# EAGLE design mimic1568_DtoA (EAGLE 7.5.0)
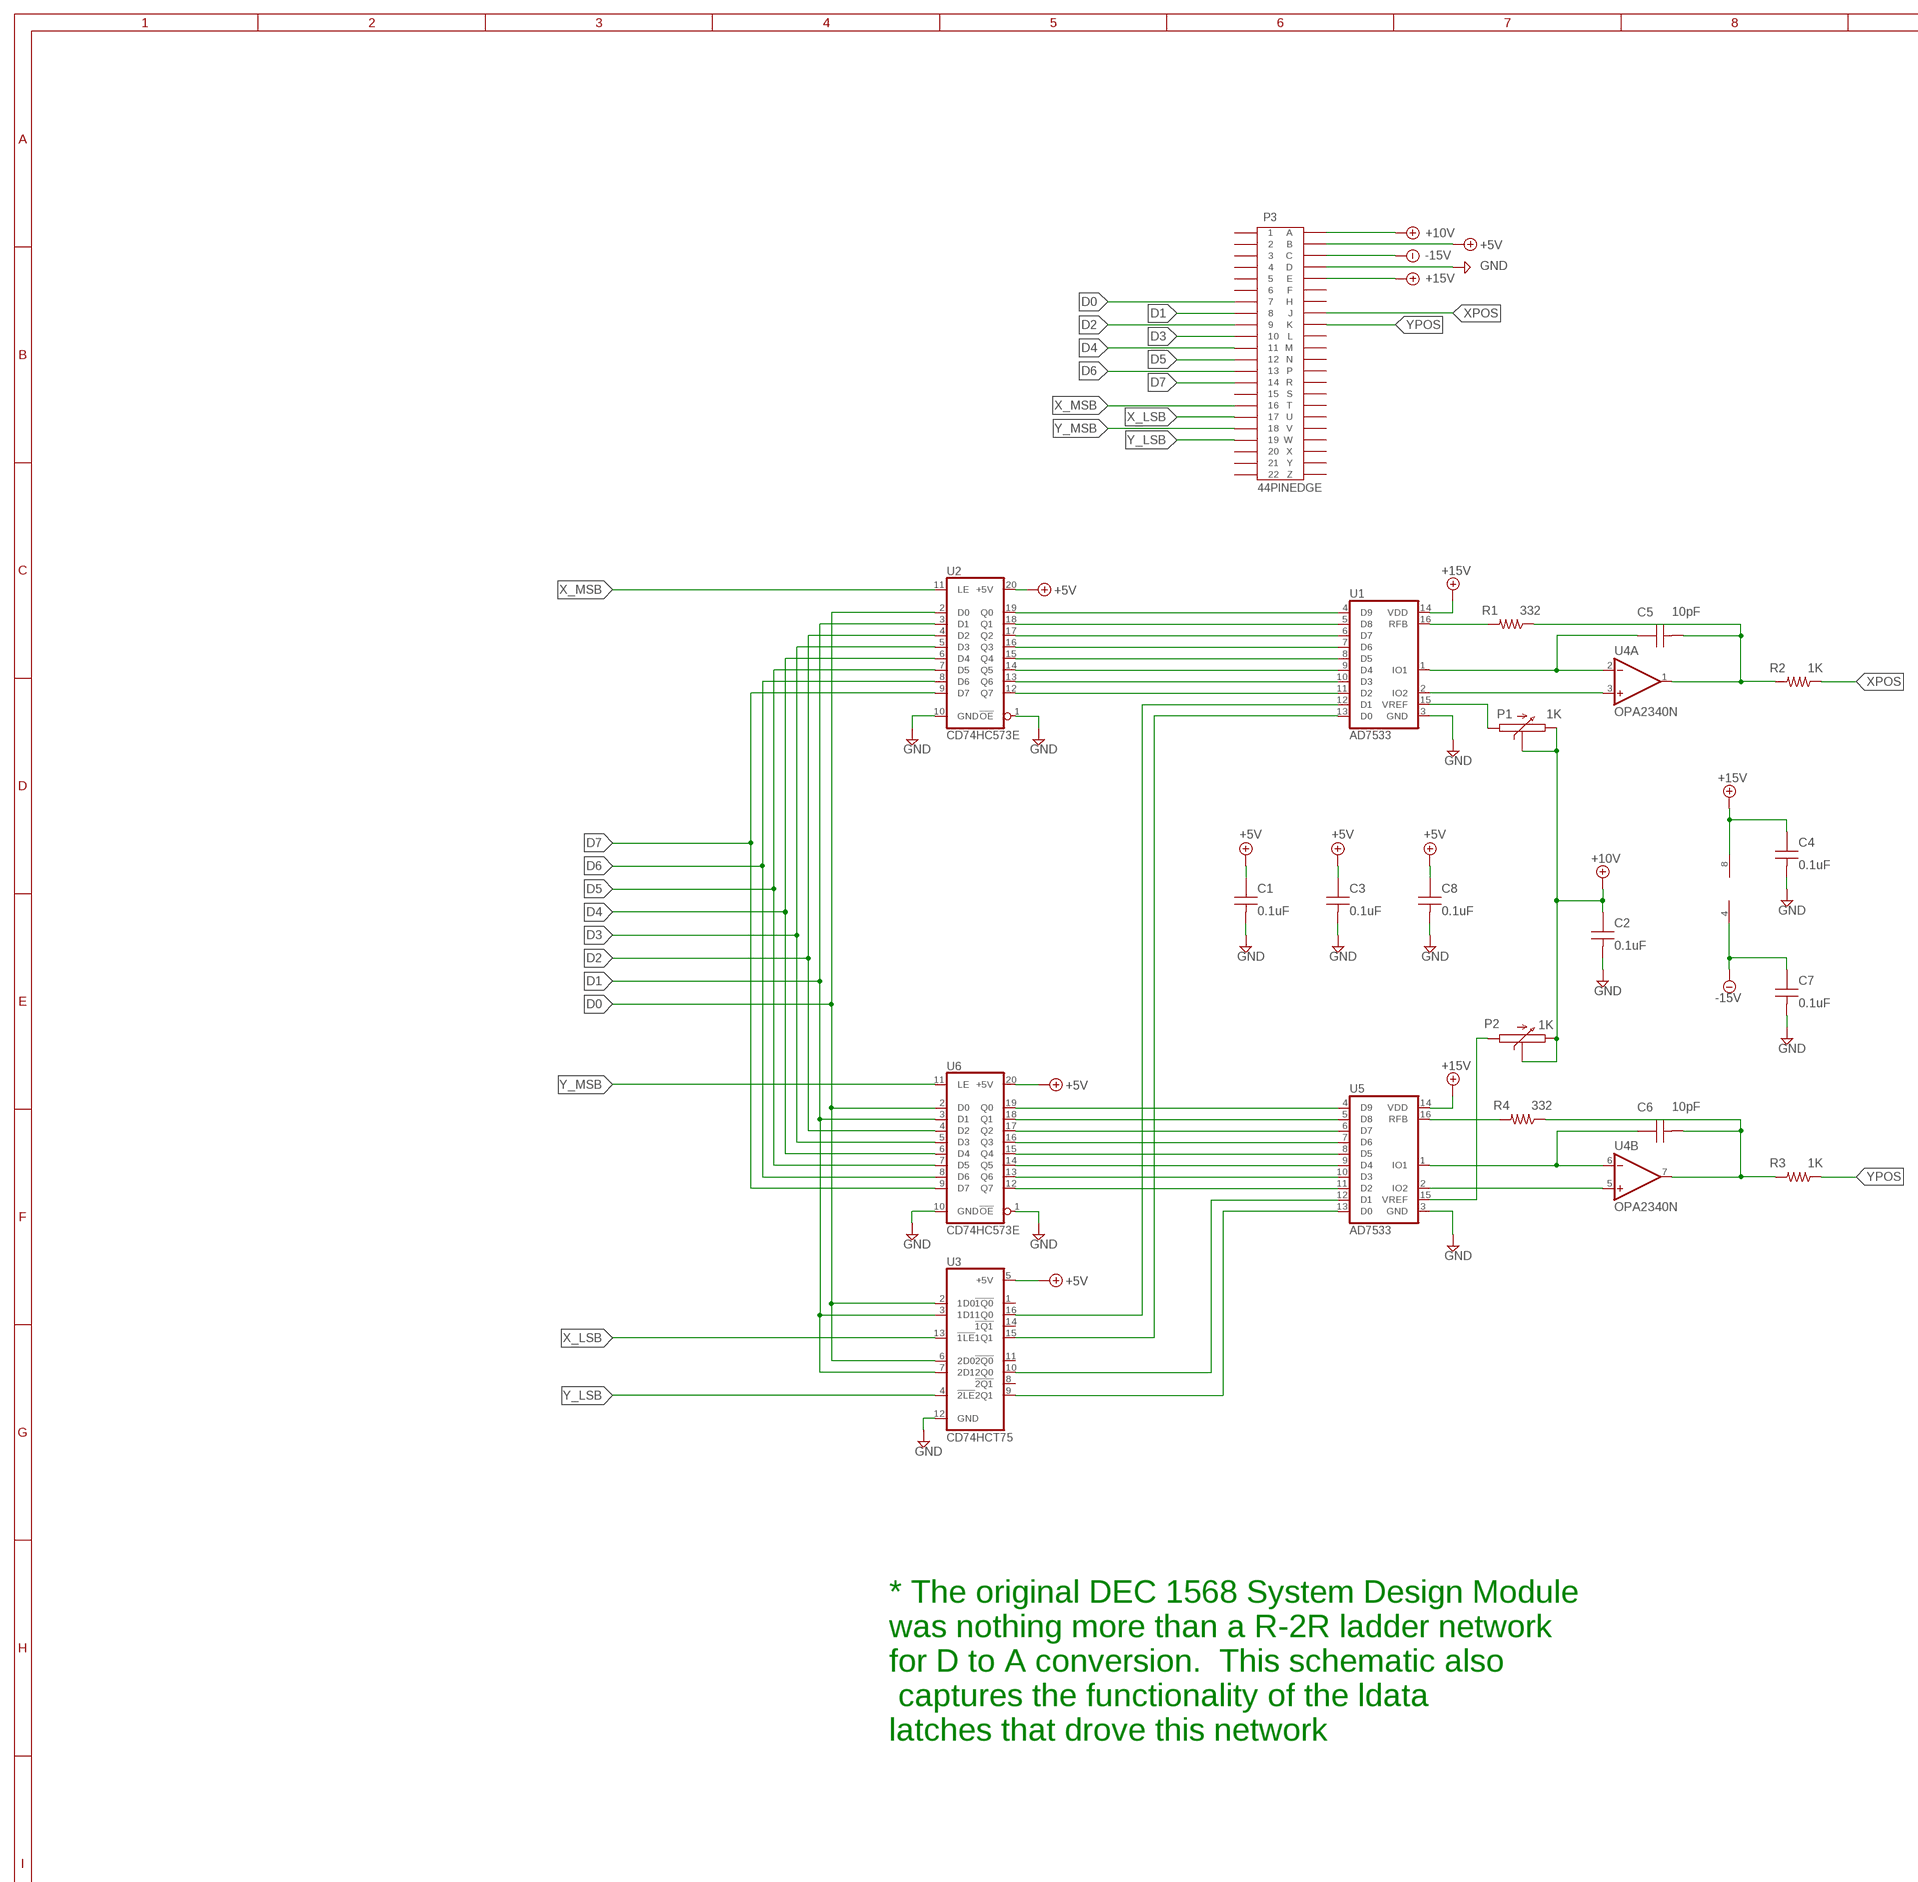
[diagram p0: schematic, sheet 1, part 1 of 2]
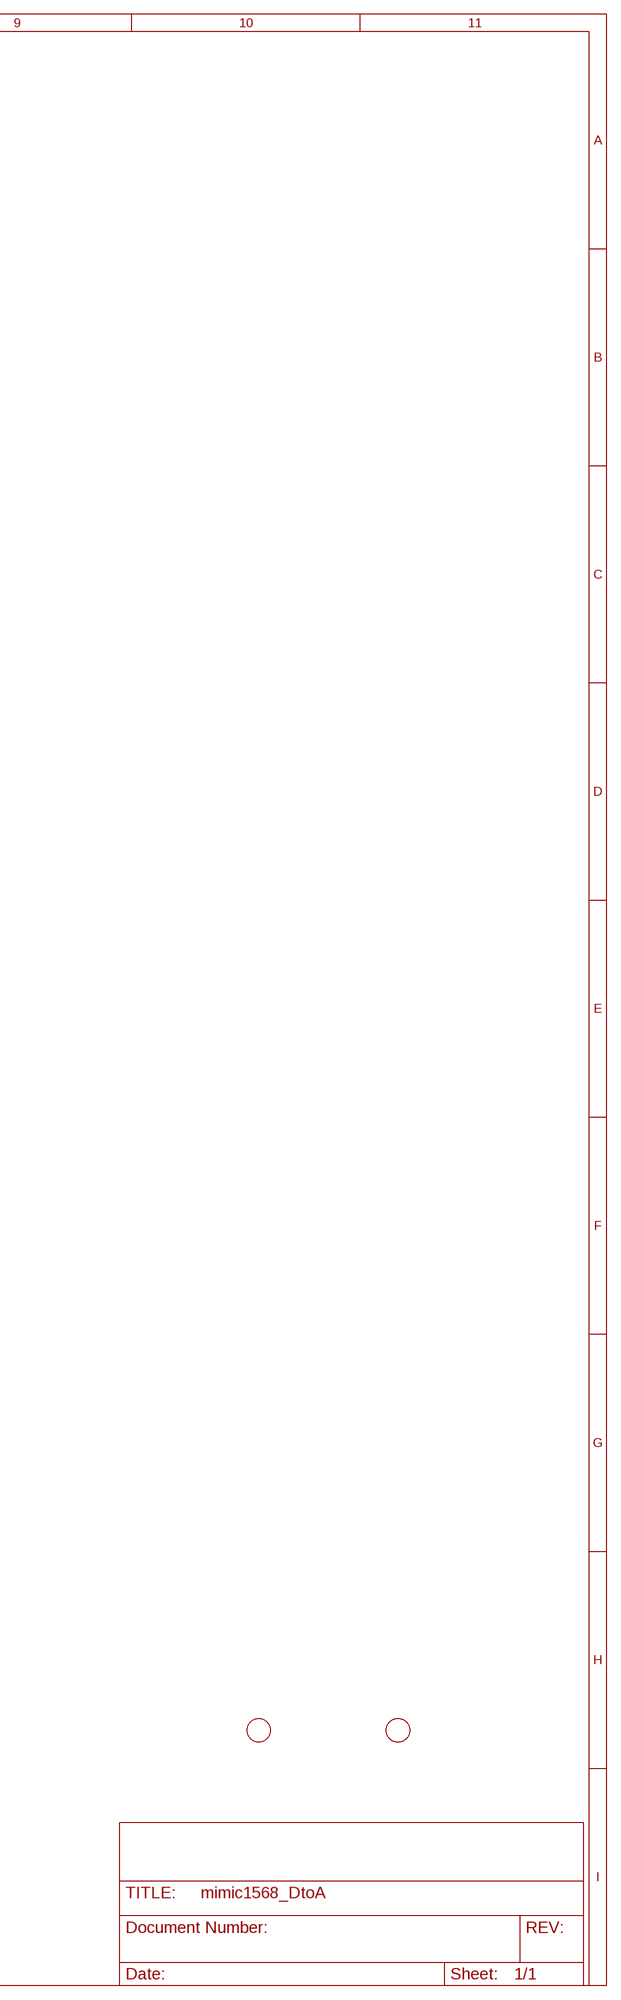
[diagram p1: schematic, sheet 1, part 2 of 2]

## Parts
C1  0.1uF  CAP0.1UF100V  [5MM_TH]
C2  0.1uF  CAP0.1UF100V  [5MM_TH]
C3  0.1uF  CAP0.1UF100V  [5MM_TH]
C4  0.1uF  CAP0.1UF100V  [5MM_TH]
C5  10pF  CAP0.1UF100V  [5MM_TH]
C6  10pF  CAP0.1UF100V  [5MM_TH]
C7  0.1uF  CAP0.1UF100V  [5MM_TH]
C8  0.1uF  CAP0.1UF100V  [5MM_TH]
P1  1K  POT-3006P  [3006P]
P2  1K  POT-3006P  [3006P]
P3  44PINEDGE  [44PINEDGE]
R1  332  R-1/4WATT  [0207/10]
R2  1K  R-1/4WATT  [0207/10]
R3  1K  R-1/4WATT  [0207/10]
R4  332  R-1/4WATT  [0207/10]
U1  AD7533  [DIP-16]
U2  CD74HC573E  [DIP-20]
U3  CD74HCT75  [DIP-16]
U4  OPA2340N  [DIP-08]
U5  AD7533  [DIP-16]
U6  CD74HC573E  [DIP-20]
U$1  FIDUCIAL  [FIDUCIAL_1MM]
U$2  FIDUCIAL  [FIDUCIAL_1MM]

## Nets
+5V: C1.1 C3.1 C8.1 P3.B U2.20(+5V) U3.5(+5V) U6.20(+5V)
+10V: C2.1 P1.2 P1.3 P2.2 P2.3 P3.A
+15V: C4.1 P3.E U1.14(VDD) U4.8(P:V+) U5.14(VDD)
-15V: C7.1 P3.C U4.4(P:V-)
D0: P3.7 U2.2(D0) U3.2(1D0) U3.6(2D0) U6.2(D0)
D1: P3.8 U2.3(D1) U3.3(1D1) U3.7(2D1) U6.3(D1)
D2: P3.9 U2.4(D2) U6.4(D2)
D3: P3.10 U2.5(D3) U6.5(D3)
D4: P3.11 U2.6(D4) U6.6(D4)
D5: P3.12 U2.7(D5) U6.7(D5)
D6: P3.13 U2.8(D6) U6.8(D6)
D7: P3.14 U2.9(D7) U6.9(D7)
GND: C1.2 C2.2 C3.2 C4.2 C7.2 C8.2 P3.D U1.3(GND) U2.1(!OE) U2.10(GND) U3.12(GND) U5.3(GND) U6.1(!OE) U6.10(GND)
N$1: U3.9(2Q1) U5.13(D0)
N$2: R4.2 U5.16(RFB)
N$3: U1.12(D1) U3.16(1Q0)
N$4: U1.13(D0) U3.15(1Q1)
N$5: C5.1 U1.1(IO1) U4.2(A:-IN)
N$6: U1.2(IO2) U4.3(A:+IN)
N$7: U5.4(D9) U6.19(Q0)
N$8: U5.5(D8) U6.18(Q1)
N$9: U5.6(D7) U6.17(Q2)
N$10: U5.7(D6) U6.16(Q3)
N$11: U5.8(D5) U6.15(Q4)
N$12: U5.9(D4) U6.14(Q5)
N$13: U5.10(D3) U6.13(Q6)
N$14: U5.11(D2) U6.12(Q7)
N$23: C5.2 R1.1 R2.2 U4.1(A:OUT)
N$24: P1.1 U1.15(VREF)
N$25: U1.4(D9) U2.19(Q0)
N$26: U1.5(D8) U2.18(Q1)
N$27: U1.6(D7) U2.17(Q2)
N$28: U1.7(D6) U2.16(Q3)
N$29: U1.8(D5) U2.15(Q4)
N$30: U1.9(D4) U2.14(Q5)
N$31: U1.10(D3) U2.13(Q6)
N$32: U1.11(D2) U2.12(Q7)
N$35: U3.10(2Q0) U5.12(D1)
N$38: R1.2 U1.16(RFB)
N$44: C6.2 R3.2 R4.1 U4.7(B:OUT)
N$45: C6.1 U4.6(B:-IN) U5.1(IO1)
N$46: U4.5(B:+IN) U5.2(IO2)
N$53: P2.1 U5.15(VREF)
X_LSB: P3.17 U3.13(!1LE)
X_MSB: P3.16 U2.11(LE)
XPOS: P3.J R2.1
Y_LSB: P3.19 U3.4(!2LE)
Y_MSB: P3.18 U6.11(LE)
YPOS: P3.K R3.1
Unconnected: P3.1 P3.2 P3.3 P3.4 P3.5 P3.6 P3.15 P3.20 P3.21 P3.22 P3.F P3.H P3.L P3.M P3.N P3.P P3.R P3.S P3.T P3.U P3.V P3.W P3.X P3.Y P3.Z U3.1(!1Q0) U3.8(!2Q1) U3.11(!2Q0) U3.14(!1Q1)

## Notes on the sheet
- * The original DEC 1568 System Design Module 
  was nothing more than a R-2R ladder network 
  for D to A conversion.  This schematic also
   captures the functionality of the ldata 
  latches that drove this network

## Library data of the parts
C1-C4 C7 C8 = keiths:CAP0.1UF100V: 0.1µF ±10% 100V Ceramic X8R TH; MPN: FA26X8R2A104KNU06
C5 C6 = keiths:CAP0.1UF100V: 0.1µF ±10% 100V Ceramic X8R TH; MPN: FA26X8R2A104KNU06; VALUE: 0.1uF
P1 P2 = keiths:POT-3006P: 3006 - Trimpot® Trimming Potentiometer. Clockwise turn moves wiper to pin 3
P3 = keiths:44PINEDGE: 44 PIN EDGE CONNECTOR FOR PCB
R1-R4 = keiths:R-1/4WATT: Quarter watt through hole resistor.
U1 U5 = keiths:AD7533: CMOS parallel input 10-Bit Multiplying DAC
U2 U6 = keiths:CD74HC573E: Octal Transparent D-Type Latches With 3-State Outputs
U3 = keiths:CD74HCT75: dual two bit transparant latch
U4 = keiths:OPA2340: SINGLE-SUPPLY, RAIL-TO-RAIL OP AMPS 5.5MHz
U$1 U$2 = adafruit:FIDUCIAL: For use by pick and place machines to calibrate the vision/machine, 1mm By microbuilder.eu

## Board
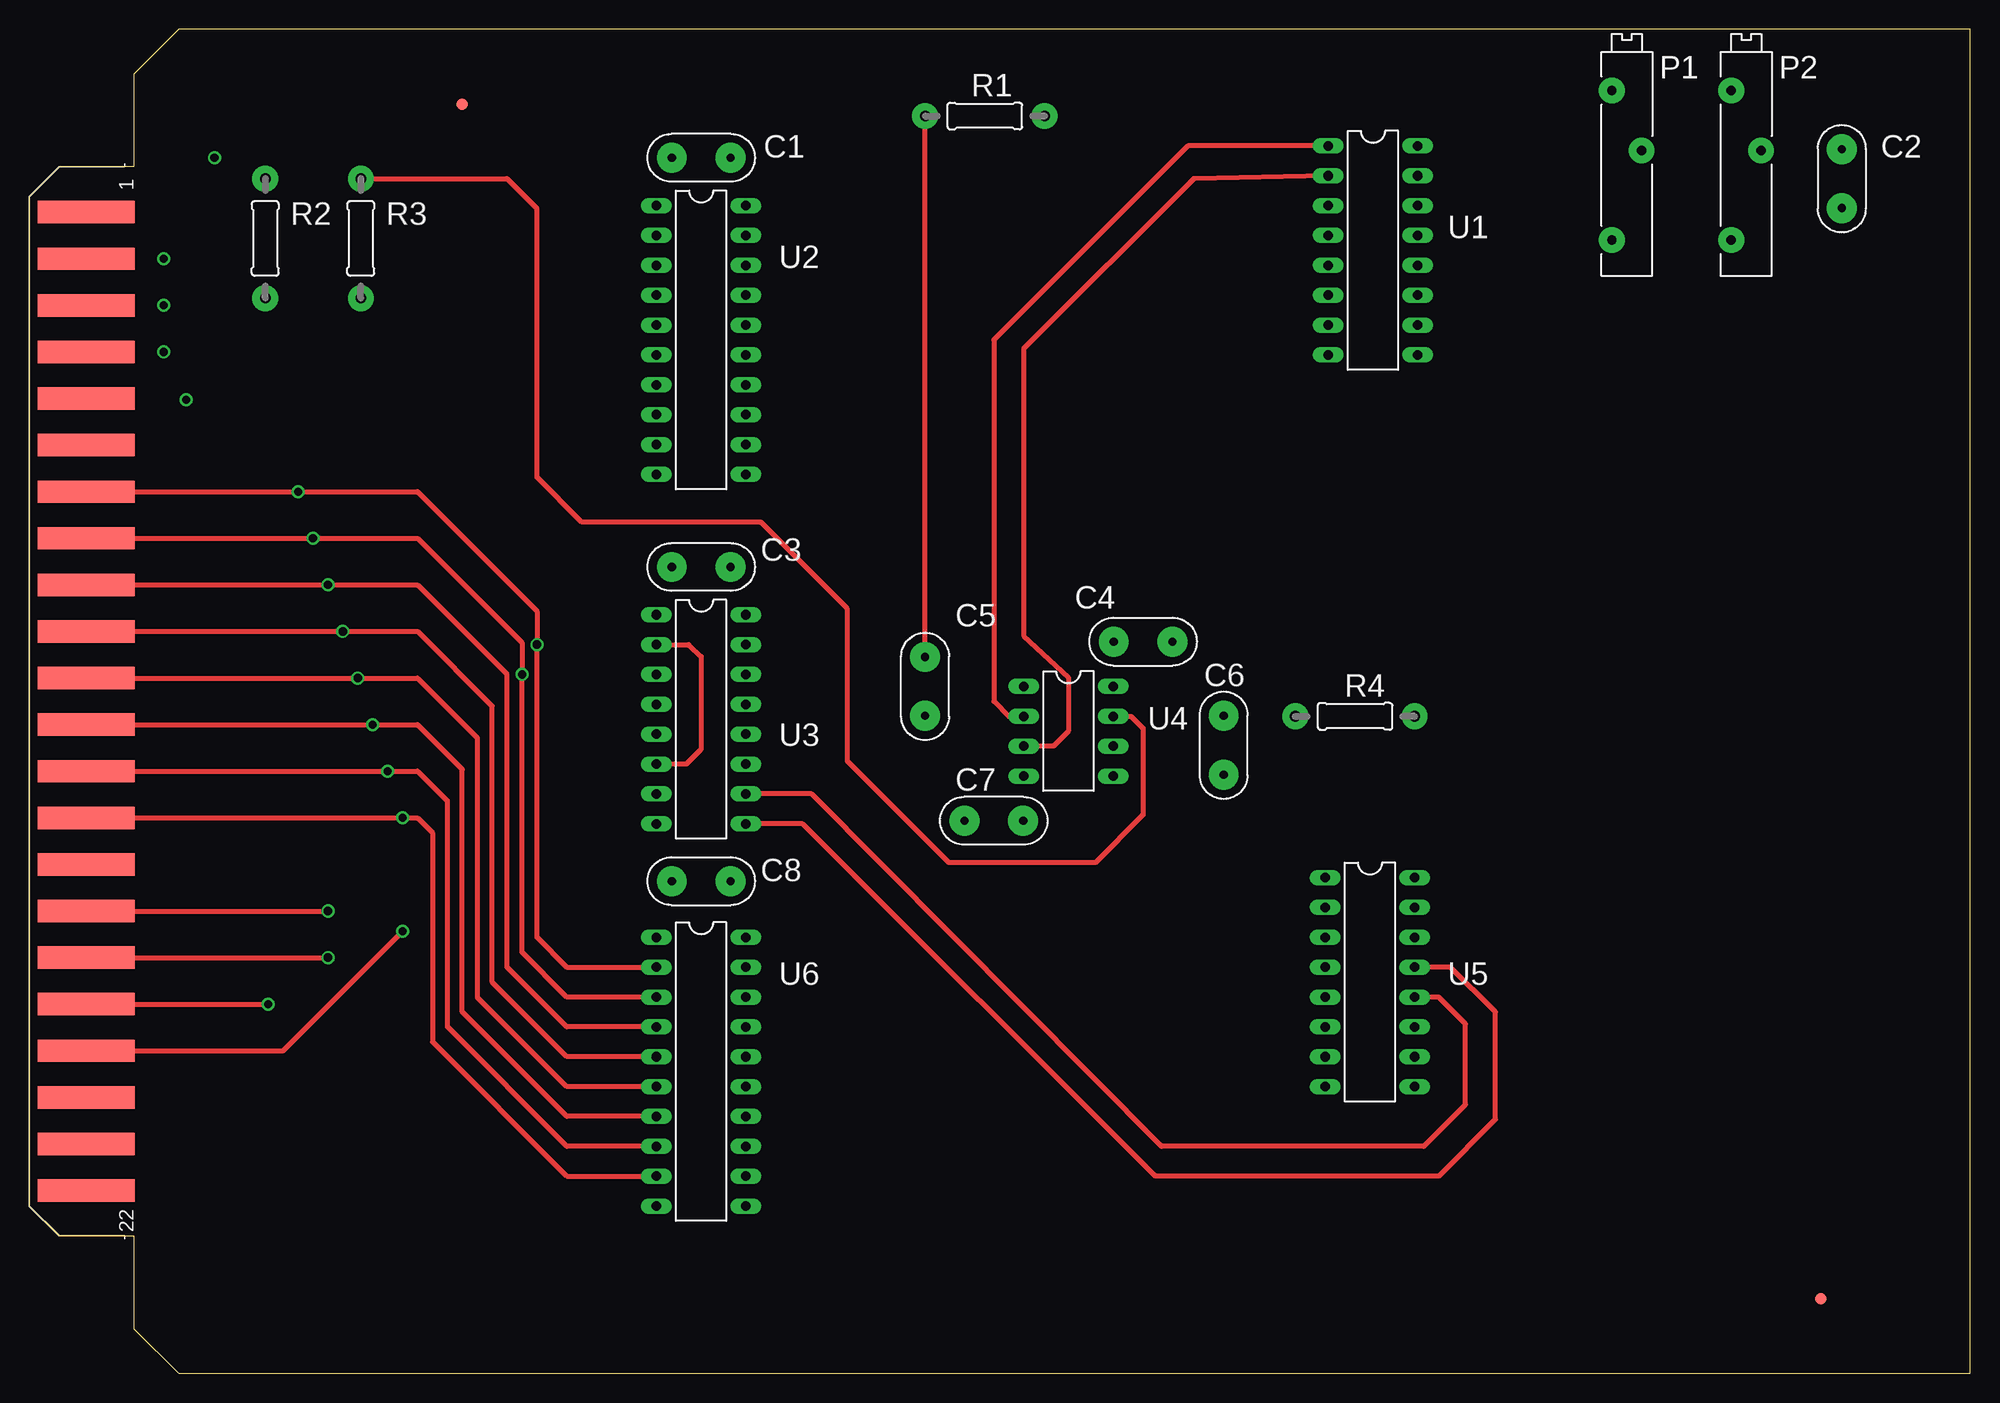
[diagram p2: board, top side]
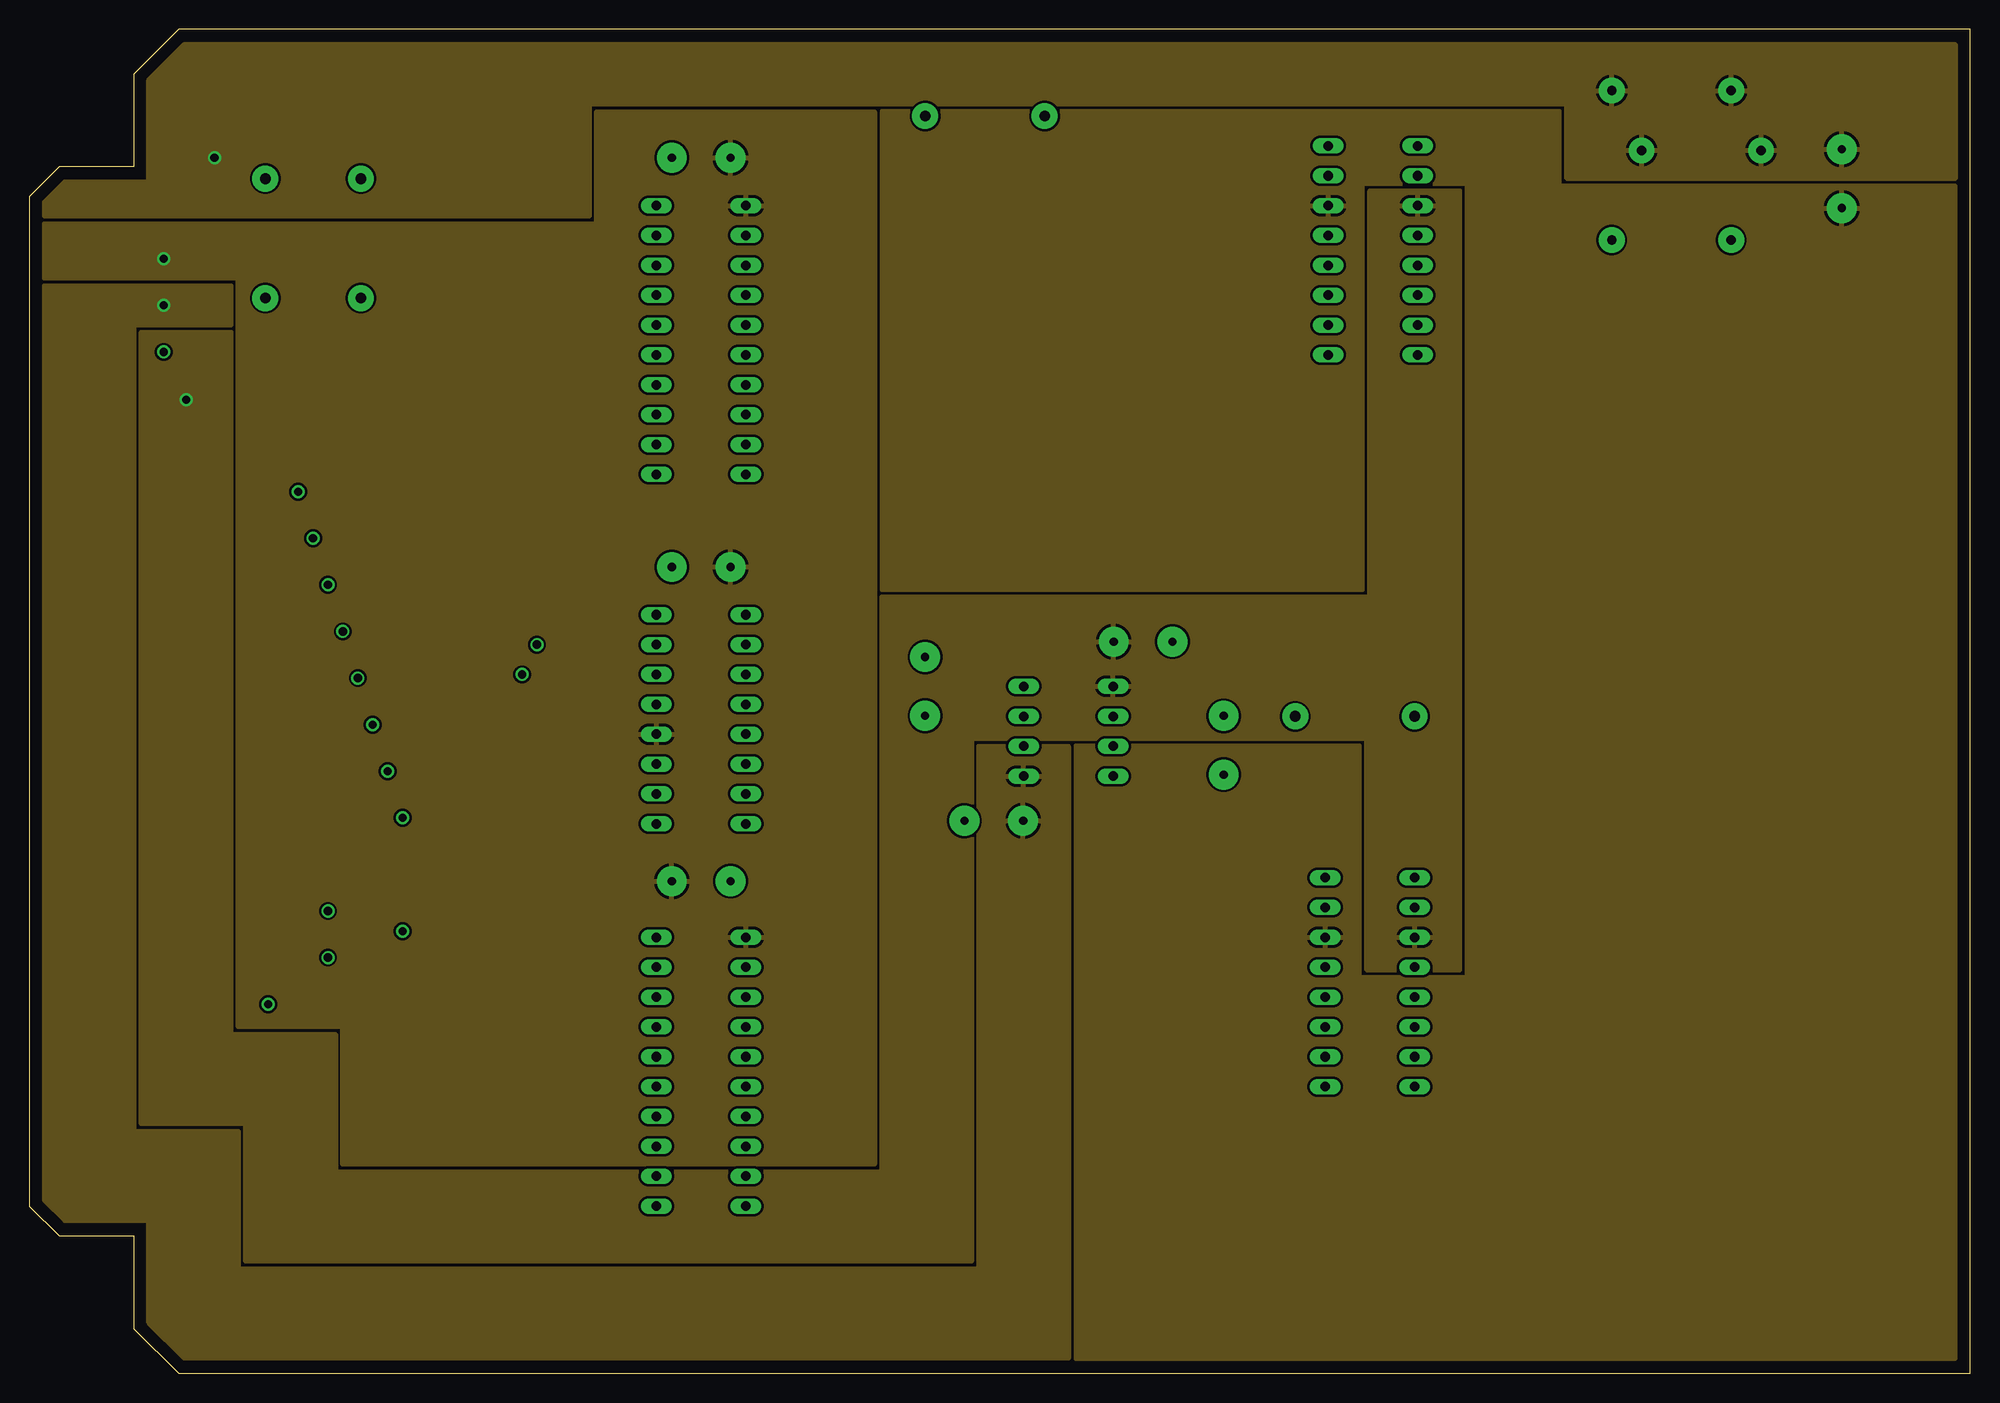
[diagram p3: board, inner layer VCC]
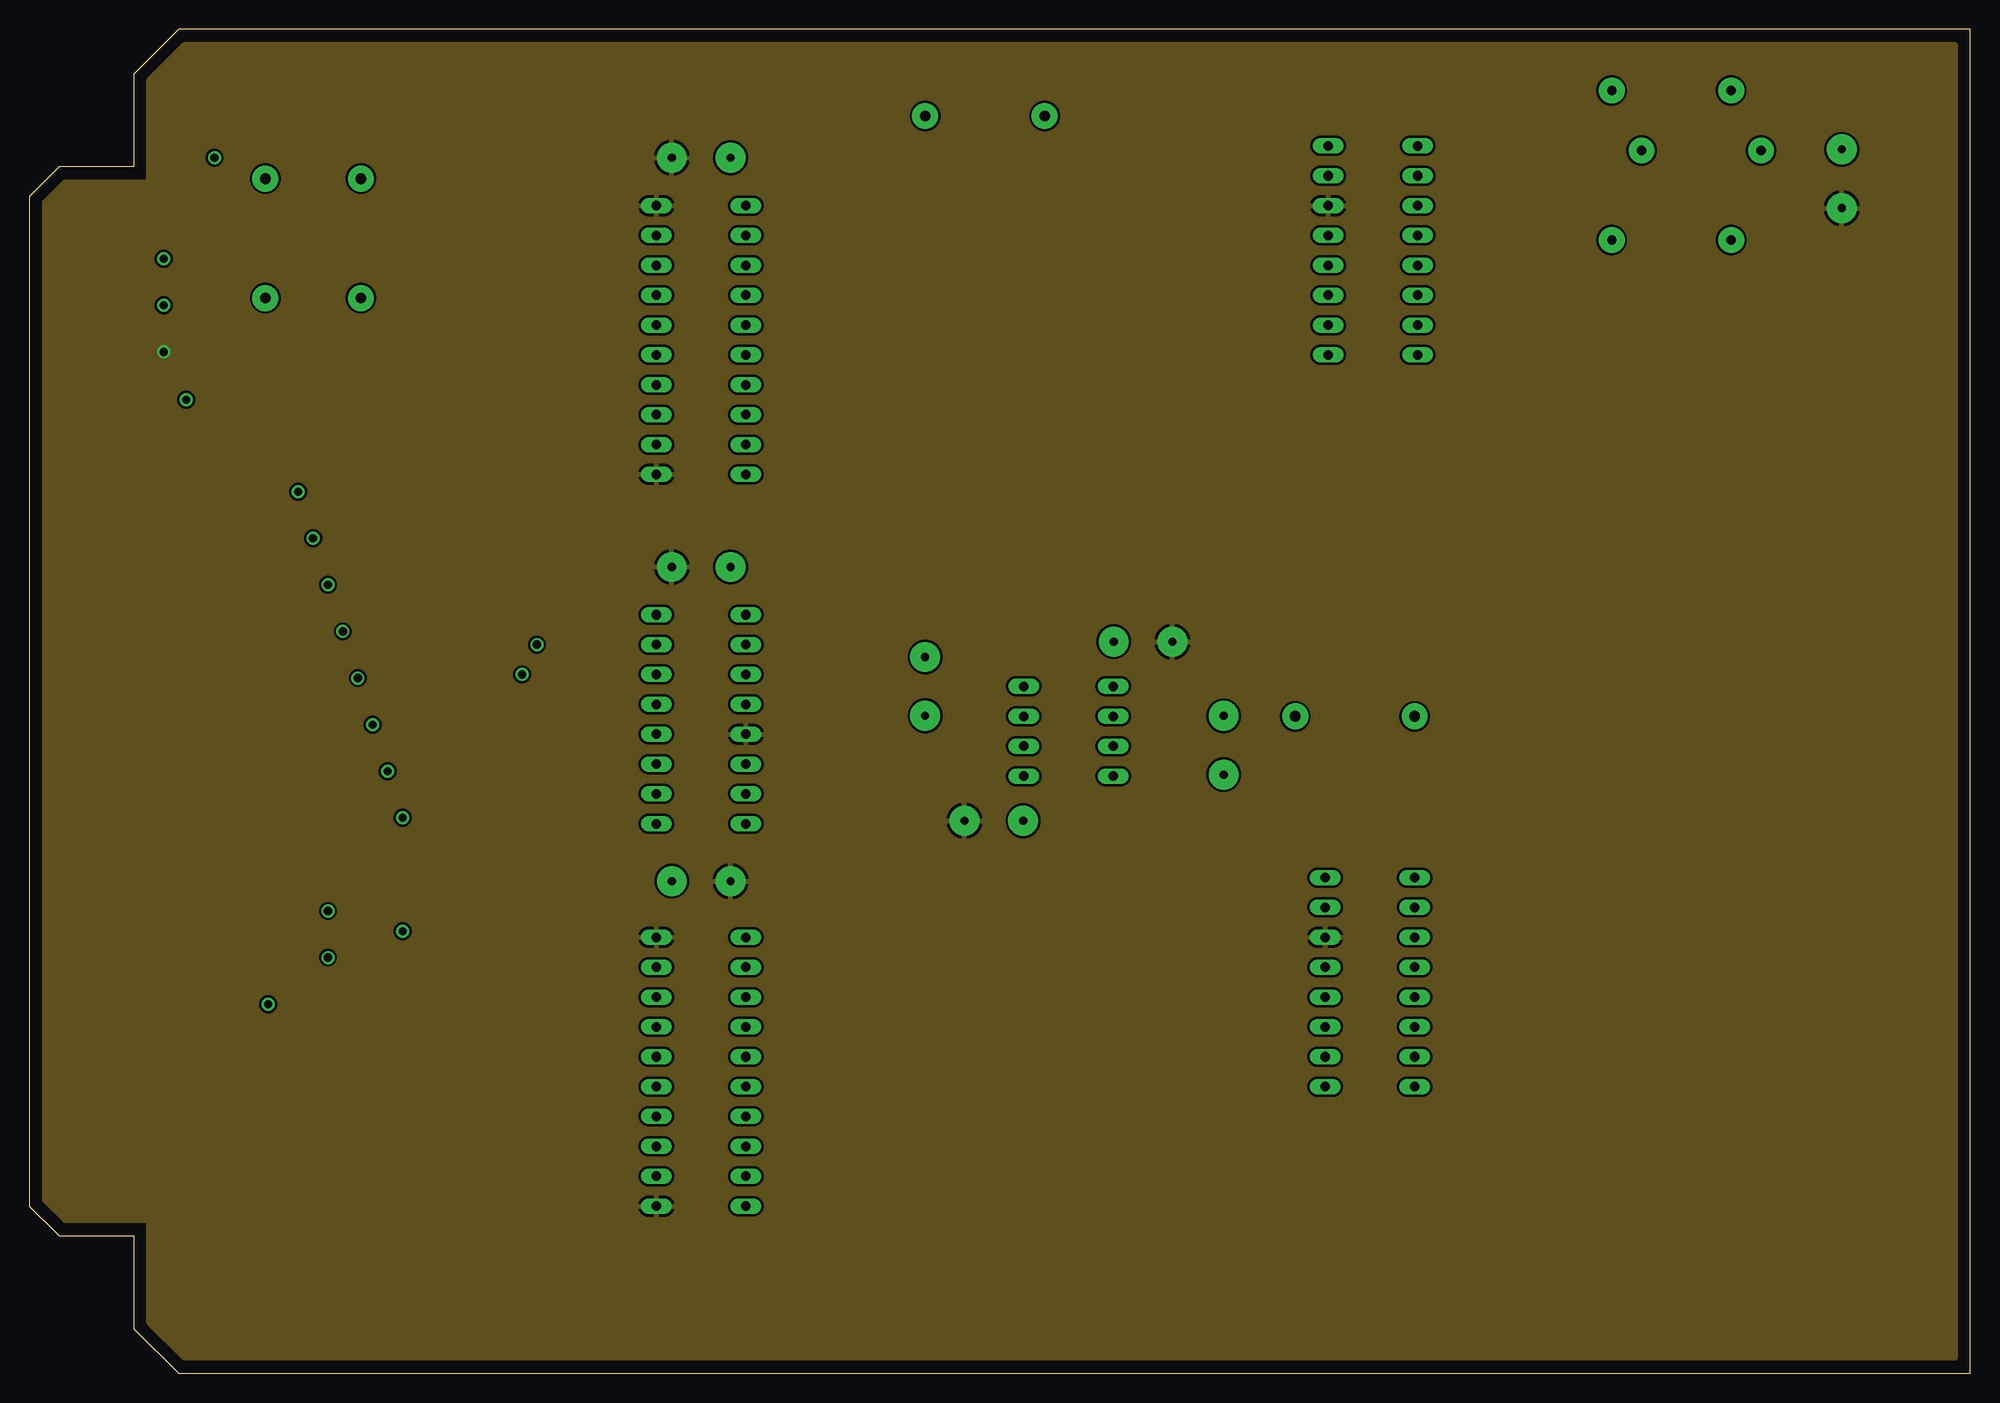
[diagram p4: board, inner layer GND]
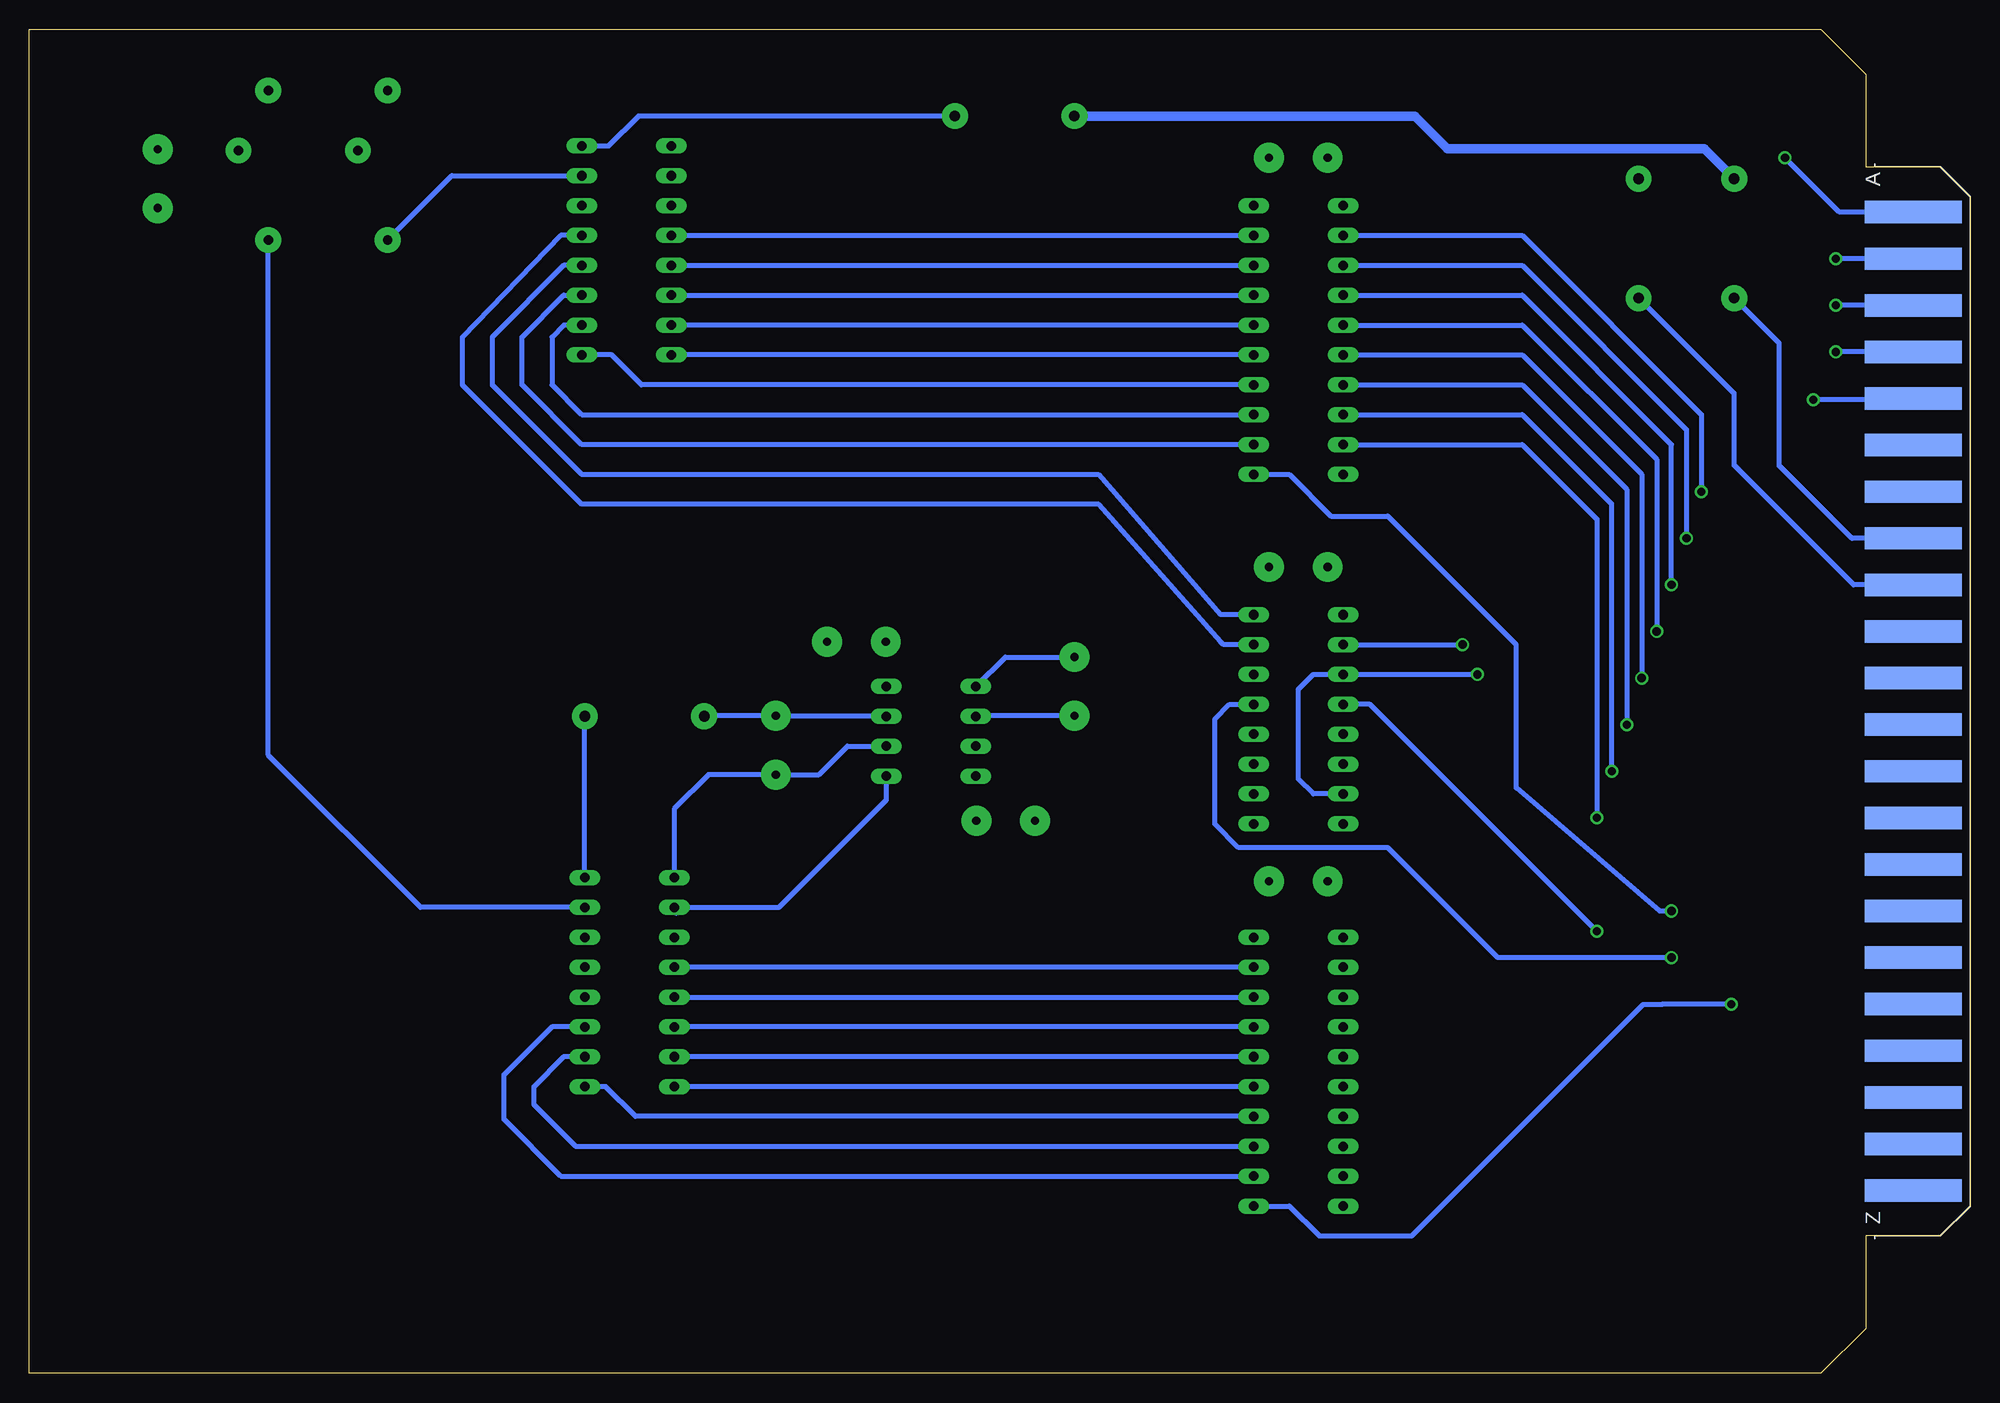
[diagram p5: board, bottom side, seen from below]

Size 165.1 x 114.3 mm. Coordinates in mm from the lower left corner, seen from the top.
Outline: 2.54,11.68 8.89,11.68 8.89,3.81 12.7,0 165.1,0 165.1,114.3 12.7,114.3 8.89,110.49 8.89,102.62 2.54,102.62 0,100.08 0,14.22 2.54,11.68
Copper layers (1+2*15+16): Top 0.035mm / dielectric 1.5mm / VCC 0.035mm / dielectric 0.15mm / GND 0.035mm / dielectric 0.2mm / Bottom 0.035mm
Design rules "default *": minimum track width 10mil, minimum drill 24mil, track to track 8mil, track to pad 8mil, pad to pad 8mil, via to via 8mil, smd to smd 8mil, copper to edge 40mil, drill to drill 8mil, minimum pad ring 10mil, minimum via ring 8mil, stop-mask expansion 4mil, vias tented up to drill 0mil, thermal gap 10mil

### Footprints (pad centres in the part's own frame; a part is rotated, then mirrored left to right if it is on the bottom)
5MM_TH = drill 0.7 pad 2.54: 1 -2.5,0; 2 2.5,0
3006P = drill 0.8 pad 2.184: 1 -6.477,1.27; 2 1.143,-1.27; 3 6.223,1.27
44PINEDGE = smd 1.905 x 8.255: 1 -41.605,4.826; 2 -37.643,4.826; 3 -33.68,4.826; 4 -29.718,4.826; 5 -25.756,4.826; 6 -21.793,4.826; 7 -17.831,4.826; 8 -13.868,4.826; 9 -9.906,4.826; 10 -5.944,4.826; 11 -1.981,4.826; 12 1.981,4.826; 13 5.944,4.826; 14 9.906,4.826; 15 13.868,4.826; 16 17.831,4.826; 17 21.793,4.826; 18 25.756,4.826; 19 29.718,4.826; 20 33.68,4.826; 21 37.643,4.826; 22 41.605,4.826 | smd 1.905 x 8.255 bottom: A -41.605,4.826; B -37.643,4.826; C -33.68,4.826; D -29.718,4.826; E -25.756,4.826; F -21.793,4.826; H -17.831,4.826; J -13.868,4.826; K -9.906,4.826; L -5.944,4.826; M -1.981,4.826; N 1.981,4.826; P 5.944,4.826; R 9.906,4.826; S 13.868,4.826; T 17.831,4.826; U 21.793,4.826; V 25.756,4.826; W 29.718,4.826; X 33.68,4.826; Y 37.643,4.826; Z 41.605,4.826
0207/10 = drill 0.9 pad 2.184: 1 -5.08,0; 2 5.08,0
DIP-16 = drill 0.813 long: 1 -8.89,-3.81; 2 -6.35,-3.81; 3 -3.81,-3.81; 4 -1.27,-3.81; 5 1.27,-3.81; 6 3.81,-3.81; 7 6.35,-3.81; 8 8.89,-3.81; 9 8.89,3.81; 10 6.35,3.81; 11 3.81,3.81; 12 1.27,3.81; 13 -1.27,3.81; 14 -3.81,3.81; 15 -6.35,3.81; 16 -8.89,3.81
DIP-20 = drill 0.813 long: 1 -11.43,-3.81; 2 -8.89,-3.81; 3 -6.35,-3.81; 4 -3.81,-3.81; 5 -1.27,-3.81; 6 1.27,-3.81; 7 3.81,-3.81; 8 6.35,-3.81; 9 8.89,-3.81; 10 11.43,-3.81; 11 11.43,3.81; 12 8.89,3.81; 13 6.35,3.81; 14 3.81,3.81; 15 1.27,3.81; 16 -1.27,3.81; 17 -3.81,3.81; 18 -6.35,3.81; 19 -8.89,3.81; 20 -11.43,3.81
DIP-08 = drill 0.813 long: 1 -3.81,-3.81; 2 -1.27,-3.81; 3 1.27,-3.81; 4 3.81,-3.81; 5 3.81,3.81; 6 1.27,3.81; 7 -1.27,3.81; 8 -3.81,3.81
FIDUCIAL_1MM = smd 1 x 1: 1 0,0

### Placement (x,y rotation side)
C1  57.15,103.38 180 top
C2  154.18,101.6 270 top
C3  57.15,68.58 180 top
C4  94.74,62.23 0 top
C5  76.2,58.42 90 top
C6  101.6,53.42 90 top
C7  82.04,46.99 180 top
C8  57.15,41.86 0 top
P1  135.89,102.87 90 top
P2  146.05,102.87 90 top
P3  0,57.15 270 top
R1  81.28,106.93 0 top
R2  20.07,96.52 90 top
R3  28.19,96.52 90 top
R4  112.78,55.88 0 top
U1  114.3,95.5 270 top
U2  57.15,87.88 270 top
U3  57.15,55.63 270 top
U4  88.39,54.61 270 top
U5  114.05,33.27 270 top
U6  57.15,25.65 270 top
U$1  36.83,107.95 0 top
U$2  152.4,6.35 0 top

### Tracks (layer width: path | path; a pad name or v marks a point on that pad's centre or on a via)
+5V  (via drill 0.7)
  Bottom 0.406: P3.B v11.43,94.79
  pour VCC: 48.26,107.31 71.88,107.31 71.88,17.78 26.67,17.78 26.67,29.46 17.78,29.46 17.78,93.12 1.27,93.12 1.27,97.79 48.26,97.79
+10V  (via drill 0.7)
  Bottom 0.406: P3.A 11.12,98.75 v15.75,103.38
  pour VCC: 47.62,98.42 1.27,98.42 1.27,99.57 3.05,101.35 10.16,101.35 10.16,109.98 13.21,113.03 163.83,113.03 163.83,101.6 130.81,101.6 130.81,107.95 47.62,107.95
+15V  (via drill 0.7)
  Bottom 0.406: P3.E 4.93,82.8 v13.34,82.8
  pour VCC: 9.53,88.54 17.14,88.54 17.14,28.83 26.04,28.83 26.04,17.14 72.52,17.14 72.52,66.04 114.05,66.04 114.05,100.58 121.67,100.58 121.67,34.29 113.79,34.29 113.79,53.98 80.14,53.98 80.14,9.53 18.41,9.53 18.41,21.21 9.53,21.21
-15V  (via drill 0.7)
  Bottom 0.406: P3.C v11.43,90.83
  pour VCC: 1.27,92.51 17.14,92.51 17.14,89.15 8.89,89.15 8.89,20.57 17.78,20.57 17.78,8.89 80.77,8.89 80.77,53.34 88.39,53.34 88.39,1.27 13.21,1.27 10.16,4.32 10.16,12.95 3.05,12.95 1.27,14.73
D0  (via drill 0.7)
  Top 0.406: P3.7 v22.86,74.98 33.02,74.98 43.18,64.82 v43.18,61.98 43.18,37.08 45.72,34.54 U6.2 | U3.2 56.08,61.98 57.15,60.96 57.15,53.09 55.88,51.82 U3.6
  Bottom 0.406: U2.2 38.1,96.77 22.86,81.53 v22.86,74.98 | U3.2 v43.18,61.98
D1  (via drill 0.7)
  Top 0.406: P3.8 v24.13,71.02 33.02,71.02 41.91,62.13 v41.91,59.44 41.91,35.81 45.72,32 U6.3
  Bottom 0.406: U2.3 38.1,94.23 24.13,80.26 v24.13,71.02 | v41.91,59.44 U3.3 55.88,59.44 57.15,58.17 57.15,50.55 55.88,49.28 U3.7
D2  (via drill 0.7)
  Top 0.406: P3.9 v25.4,67.06 33.02,67.06 40.64,59.44 40.64,34.54 45.72,29.46 U6.4
  Bottom 0.406: U2.4 38.1,91.69 25.4,78.99 v25.4,67.06
D3  (via drill 0.7)
  Top 0.406: P3.10 v26.67,63.09 33.02,63.09 39.37,56.74 39.37,33.27 45.72,26.92 U6.5
  Bottom 0.406: U2.5 38.1,89.15 26.67,77.72 v26.67,63.09
D4  (via drill 0.7)
  Top 0.406: P3.11 v27.94,59.13 33.02,59.13 38.1,54.05 38.1,32 45.72,24.38 U6.6
  Bottom 0.406: U2.6 38.1,86.61 27.94,76.45 v27.94,59.13
D5  (via drill 0.7)
  Top 0.406: P3.12 v29.21,55.17 33.02,55.17 36.83,51.36 36.83,30.73 45.72,21.84 U6.7
  Bottom 0.406: U2.7 38.1,84.07 29.21,75.18 v29.21,55.17
D6  (via drill 0.7)
  Top 0.406: P3.13 v30.48,51.21 33.02,51.21 35.56,48.67 35.56,29.46 45.72,19.3 U6.8
  Bottom 0.406: U2.8 38.1,81.53 30.48,73.91 v30.48,51.21
D7  (via drill 0.7)
  Top 0.406: P3.14 v31.75,47.24 33.02,47.24 34.29,45.97 34.29,28.19 45.72,16.76 U6.9
  Bottom 0.406: U2.9 38.1,78.99 31.75,72.64 v31.75,47.24
GND  (via drill 0.7)
  Bottom 0.406: P3.D v11.43,86.87
  pour GND: 10.16,109.98 13.21,113.03 163.83,113.03 163.83,1.27 13.21,1.27 10.16,4.32 10.16,12.95 3.05,12.95 1.27,14.73 1.27,99.57 3.05,101.35 10.16,101.35
  pour VCC: 72.52,107.31 72.52,66.67 113.41,66.67 113.41,101.22 122.3,101.22 122.3,33.66 113.16,33.66 113.16,53.34 89.03,53.34 89.03,1.27 163.83,1.27 163.83,100.97 130.18,100.97 130.18,107.31
N$1
  Top 0.406: U3.9 65.79,46.74 95.81,16.76 119.89,16.76 124.71,21.59 124.71,30.73 120.9,34.54 U5.13
N$2
  Bottom 0.406: U5.16 R4.2
N$3
  Bottom 0.406: U1.12 119.63,94.23 125.73,88.14 125.73,84.07 118.11,76.45 74.17,76.45 63.75,64.52 U3.16
N$4
  Bottom 0.406: U1.13 119.89,96.77 128.27,88.14 128.27,84.07 118.11,73.91 74.17,73.91 63.75,62.23 63.5,61.98 U3.15
N$5
  Top 0.406: U1.1 98.55,104.39 82.04,87.88 82.04,57.15 83.31,55.88 U4.2
  Bottom 0.406: C5.1 84.54,55.92 U4.2
N$6
  Top 0.406: U1.2 99.06,101.6 84.58,87.12 84.58,62.74 88.39,59.18 88.39,54.61 87.12,53.34 U4.3
N$7
  Bottom 0.406: U6.19 U5.4
N$8
  Bottom 0.406: U5.5 U6.18
N$9
  Bottom 0.406: U6.17 U5.6
N$10
  Bottom 0.406: U6.16 U5.7
N$11
  Bottom 0.406: U6.15 U5.8
N$12
  Bottom 0.406: U6.14 113.54,21.84 116.08,24.38 U5.9
N$13
  Bottom 0.406: U5.10 119.63,26.92 122.17,24.38 122.17,22.86 118.62,19.3 U6.13
N$14
  Bottom 0.406: U5.11 120.65,29.46 124.71,25.4 124.71,21.59 119.89,16.76 U6.12
N$23
  Top 0.406: C5.2 R1.1
  Bottom 0.406: U4.1 82.08,60.92 C5.2
  Bottom 0.813: R1.1 47.24,106.93 44.45,104.14 22.61,104.14 R2.2
N$24
  Bottom 0.406: P1.1 129.16,101.85 U1.15
N$25
  Bottom 0.406: U1.4 U2.19
N$26
  Bottom 0.406: U1.5 U2.18
N$27
  Bottom 0.406: U1.6 U2.17
N$28
  Bottom 0.406: U2.16 U1.7
N$29
  Bottom 0.406: U2.15 U1.8
N$30
  Bottom 0.406: U2.14 113.03,84.07 115.57,86.61 U1.9
N$31
  Bottom 0.406: U2.13 118.11,81.53 120.65,84.07 120.65,88.14 119.63,89.15 U1.10
N$32
  Bottom 0.406: U2.12 118.11,78.99 123.19,84.07 123.19,88.14 119.63,91.69 U1.11
N$35
  Top 0.406: U3.10 66.55,49.28 96.32,19.3 118.62,19.3 122.17,22.86 122.17,29.72 119.89,32 U5.12
  Bottom 0.254: 61.27,49.15 U3.10
N$38
  Bottom 0.406: U1.16 115.82,104.39 113.28,106.93 R1.2
N$44
  Top 0.406: U4.7 93.73,55.88 94.74,54.86 94.74,47.5 90.68,43.43 78.23,43.43 69.6,52.07 69.6,65.02 62.23,72.39 46.99,72.39 43.18,76.2 43.18,99.06 40.64,101.6 R3.2
  Bottom 0.406: U4.7 92.2,55.92 C6.2 107.66,55.92 R4.1
N$45
  Bottom 0.406: U4.6 95.5,53.34 97.93,50.92 C6.1 107.33,50.92 110.24,48.01 U5.1
N$46
  Bottom 0.254: 110.08,39.01 U5.2
  Bottom 0.406: U5.2 101.35,39.62 92.2,48.77 U4.5
N$53
  Bottom 0.406: U5.15 131.83,39.62 144.78,52.58 P2.1
X_LSB  (via drill 0.7)
  Top 0.406: P3.17 v25.4,35.36
  Bottom 0.406: v25.4,35.36 40.18,35.36 49.53,44.7 62.23,44.7 64.26,46.74 64.26,55.63 62.99,56.9 U3.13
X_MSB  (via drill 0.7)
  Top 0.406: P3.16 v25.4,39.32
  Bottom 0.406: U2.11 57.91,76.45 54.36,72.9 49.53,72.9 38.61,61.98 38.61,49.78 26.42,39.32 v25.4,39.32
XPOS
  Bottom 0.406: P3.J 10.06,71.02 16.26,77.22 16.26,87.63 R2.1
Y_LSB  (via drill 0.7)
  Top 0.406: P3.19 21.59,27.43 v31.75,37.59
  Bottom 0.406: v31.75,37.59 51.05,56.9 U3.4
Y_MSB  (via drill 0.7)
  Top 0.406: P3.18 v20.32,31.39
  Bottom 0.406: v20.32,31.39 26.16,31.39 26.19,31.37 27.81,31.37 47.5,11.68 55.37,11.68 57.91,14.22 U6.11
YPOS
  Bottom 0.406: P3.K 9.91,67.06 20.07,77.22 20.07,83.31 R3.1

### Text on the board
logo: board type 1568 / X Y Digital to Analog